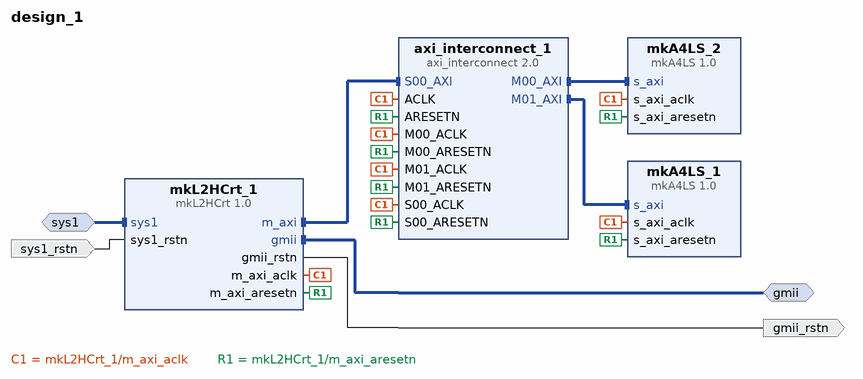
[diagram p0: block diagram of the top level]
# Vivado block design design_1, Vivado 2013.1
create_bd_design design_1

create_bd_intf_port -mode Master -vlnv xilinx.com:interface:gmii_rtl:1.0 gmii
create_bd_intf_port -mode Slave -vlnv xilinx.com:interface:diff_clock_rtl:1.0 sys1
create_bd_port -dir O -type rst gmii_rstn
set_property -dict {CONFIG.POLARITY ACTIVE_LOW} [get_bd_ports gmii_rstn]
create_bd_port -dir I sys1_rstn

create_bd_cell -type ip -vlnv atomicrules.com:hotline:mkA4LS:1.0 mkA4LS_1
create_bd_cell -type ip -vlnv atomicrules.com:hotline:mkL2HCrt:1.0 mkL2HCrt_1
create_bd_cell -type ip -vlnv atomicrules.com:hotline:mkA4LS:1.0 mkA4LS_2
create_bd_cell -type ip -vlnv xilinx.com:ip:axi_interconnect:2.0 axi_interconnect_1
set_property -dict {CONFIG.NUM_SI 1 CONFIG.NUM_MI 2} [get_bd_cells axi_interconnect_1]

# ---- connections ----

connect_bd_intf_net [get_bd_intf_pins mkL2HCrt_1/m_axi] [get_bd_intf_pins axi_interconnect_1/S00_AXI]
connect_bd_intf_net [get_bd_intf_pins axi_interconnect_1/M00_AXI] [get_bd_intf_pins mkA4LS_2/s_axi]
connect_bd_intf_net [get_bd_intf_pins axi_interconnect_1/M01_AXI] [get_bd_intf_pins mkA4LS_1/s_axi]
connect_bd_intf_net [get_bd_intf_ports gmii] [get_bd_intf_pins mkL2HCrt_1/gmii]
connect_bd_intf_net -intf_net sys1_1 [get_bd_intf_ports sys1] [get_bd_intf_pins mkL2HCrt_1/sys1]
connect_bd_net [get_bd_pins mkL2HCrt_1/m_axi_aclk] \
  [get_bd_pins mkA4LS_2/s_axi_aclk] [get_bd_pins axi_interconnect_1/ACLK] [get_bd_pins axi_interconnect_1/M00_ACLK] \
  [get_bd_pins axi_interconnect_1/M01_ACLK] [get_bd_pins mkA4LS_1/s_axi_aclk] [get_bd_pins axi_interconnect_1/S00_ACLK]
connect_bd_net [get_bd_pins mkL2HCrt_1/m_axi_aresetn] \
  [get_bd_pins axi_interconnect_1/ARESETN] [get_bd_pins axi_interconnect_1/S00_ARESETN] \
  [get_bd_pins axi_interconnect_1/M00_ARESETN] [get_bd_pins axi_interconnect_1/M01_ARESETN] \
  [get_bd_pins mkA4LS_2/s_axi_aresetn] [get_bd_pins mkA4LS_1/s_axi_aresetn]
connect_bd_net [get_bd_pins mkL2HCrt_1/gmii_rstn] [get_bd_ports gmii_rstn]
connect_bd_net [get_bd_ports sys1_rstn] [get_bd_pins mkL2HCrt_1/sys1_rstn]

# ---- address map ----
assign_bd_address -offset 0x10000000 -range 4K -target_address_space [get_bd_addr_spaces mkL2HCrt_1/m_axi] [get_bd_addr_segs mkA4LS_1/s_axi/reg0]
assign_bd_address -offset 0x10010000 -range 4K -target_address_space [get_bd_addr_spaces mkL2HCrt_1/m_axi] [get_bd_addr_segs mkA4LS_2/s_axi/reg0]

validate_bd_design
save_bd_design
